# EAGLE design PNPController (EAGLE 9.4.2)
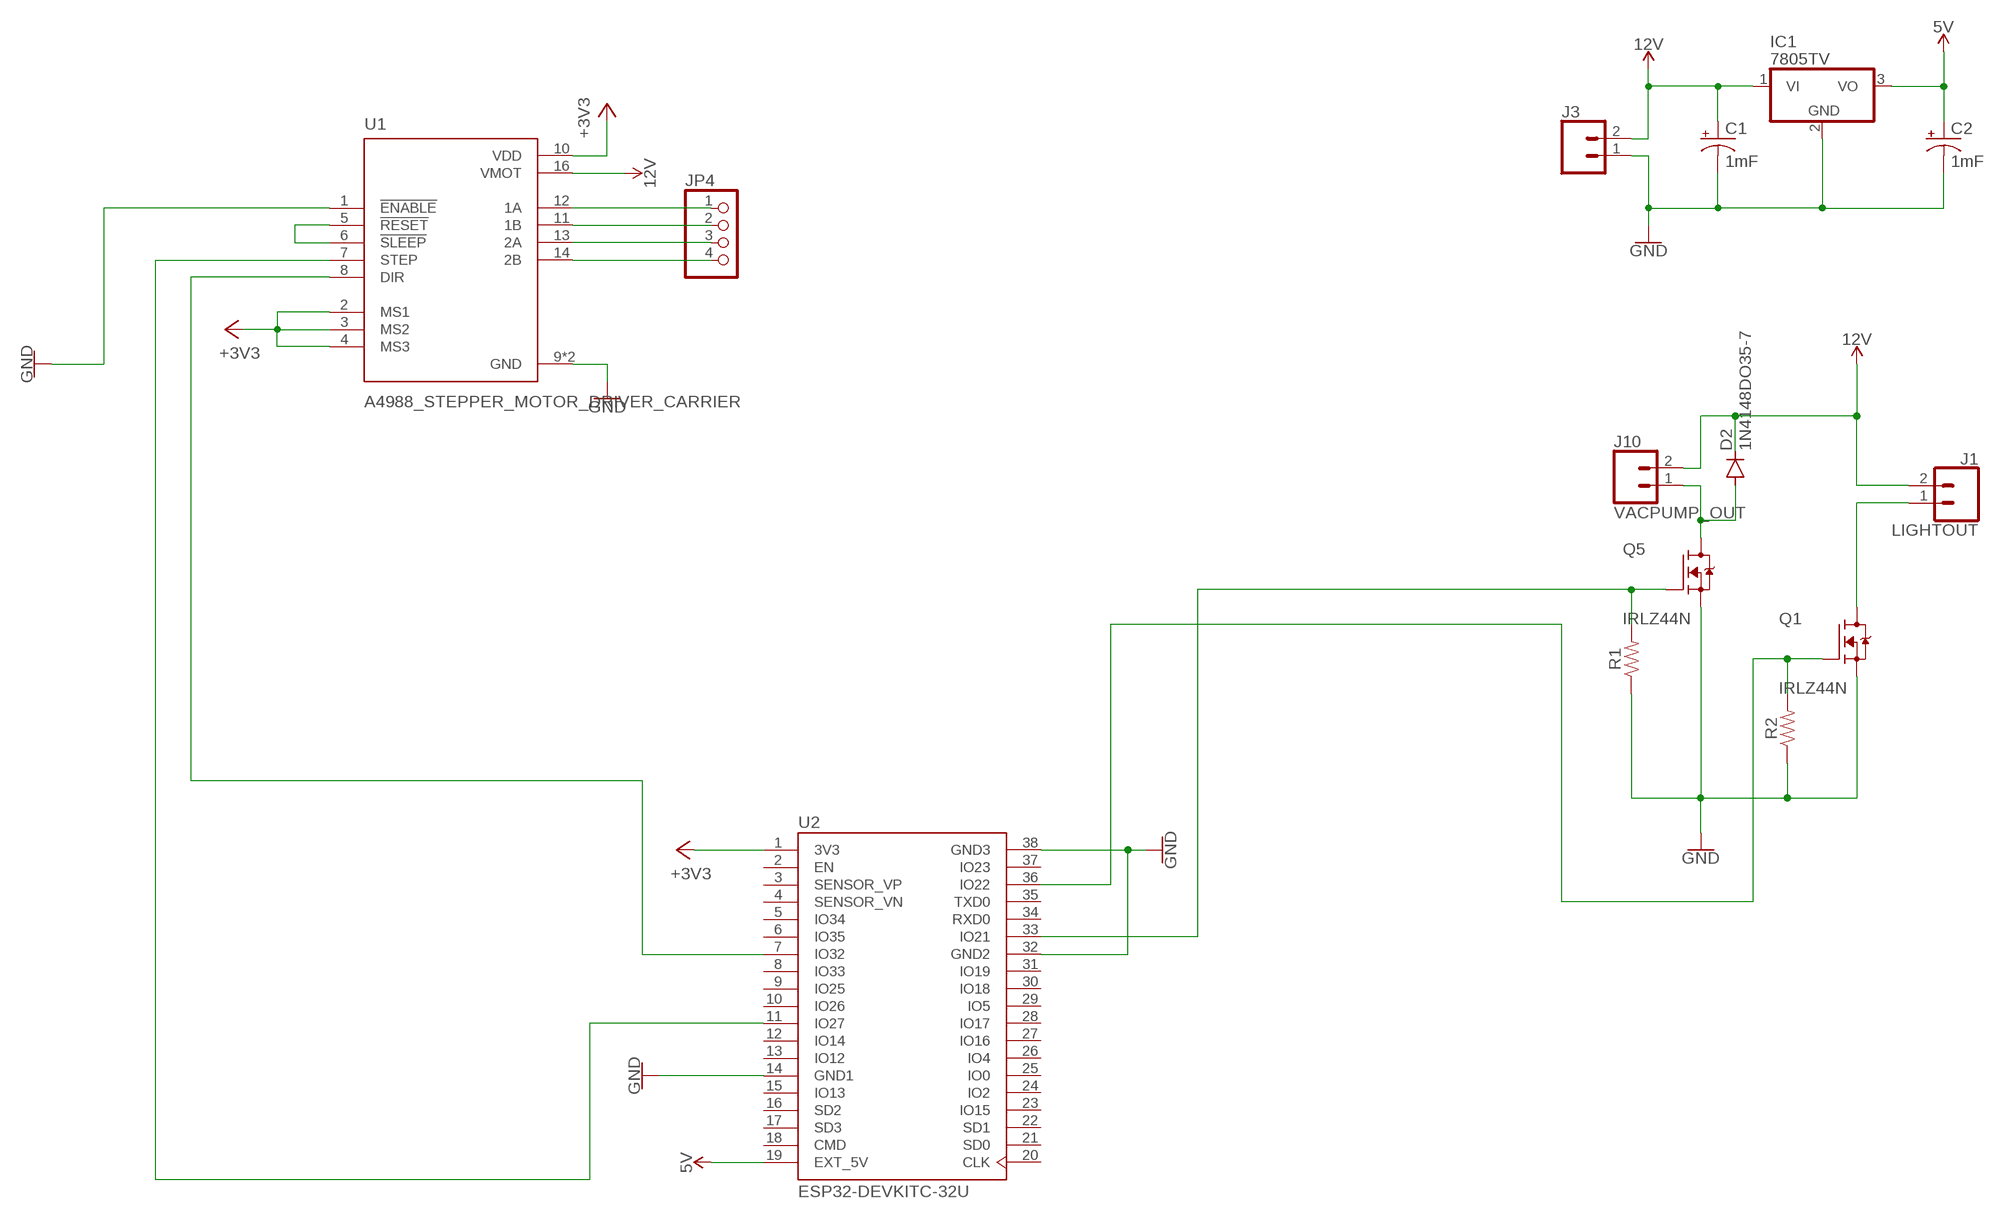
[diagram p0: schematic, sheet 1]

## Parts
C1  1mF  1000UF-RADIAL-5MM-25V-20%  [CPOL-RADIAL-5MM-10MM]
C2  1mF  1000UF-RADIAL-5MM-25V-20%  [CPOL-RADIAL-5MM-10MM]
D2  1N4148DO35-7  [DO35-7]
IC1  7805TV  [TO220V]
J1  LIGHTOUT  CONN_023.5MM  [SCREWTERMINAL-3.5MM-2]
J3  CONN_025MM  [SCREWTERMINAL-5MM-2]
J10  VACPUMP_OUT  CONN_023.5MM  [SCREWTERMINAL-3.5MM-2]
JP4  PINHD-1X4  [1X04]
Q1  IRLZ44N  [TO254P1054X469X1930-3]
Q5  IRLZ44N  [TO254P1054X469X1930-3]
R1  RESISTORAXIAL-0.3  [AXIAL-0.3]
R2  RESISTORAXIAL-0.3  [AXIAL-0.3]
U1  A4988_STEPPER_MOTOR_DRIVER_CARRIER  [MODULE_A4988_STEPPER_MOTOR_DRIVER_CARRIER]
U2  ESP32-DEVKITC-32U  [MODULE_ESP32-DEVKITC-32U]

## Nets
5V: C2.+ IC1.3(VO) U2.19(EXT_5V)
12V: C1.+ D2.C IC1.1(VI) J1.2 J3.2 J10.2 U1.16(VMOT)
+3V3: U1.2(MS1) U1.3(MS2) U1.4(MS3) U1.10(VDD) U2.1(3V3)
GND: C1.- C2.- IC1.2(GND) J3.1 Q1.3(S) Q5.3(S) R1.P$1 R2.P$1 U1.1(!ENABLE) U1.9(GND) U1.15(GND) U2.14(GND1) U2.32(GND2) U2.38(GND3)
N$3: JP4.1 U1.12(1A)
N$4: JP4.2 U1.11(1B)
N$6: JP4.3 U1.13(2A)
N$7: JP4.4 U1.14(2B)
N$12: U1.5(!RESET) U1.6(!SLEEP)
N$15: D2.A J10.1 Q5.2(D)
N$16: J1.1 Q1.2(D)
N$19: Q5.1(G) R1.P$2 U2.33(IO21)
N$20: Q1.1(G) R2.P$2 U2.36(IO22)
N$22: U1.7(STEP) U2.11(IO27)
N$23: U1.8(DIR) U2.7(IO32)
Unconnected: U2.2(EN) U2.3(SENSOR_VP) U2.4(SENSOR_VN) U2.5(IO34) U2.6(IO35) U2.8(IO33) U2.9(IO25) U2.10(IO26) U2.12(IO14) U2.13(IO12) U2.15(IO13) U2.16(SD2) U2.17(SD3) U2.18(CMD) U2.20(CLK) U2.21(SD0) U2.22(SD1) U2.23(IO15) U2.24(IO2) U2.25(IO0) U2.26(IO4) U2.27(IO16) U2.28(IO17) U2.29(IO5) U2.30(IO18) U2.31(IO19) U2.34(RXD0) U2.35(TXD0) U2.37(IO23)

## Library data of the parts
C1 C2 = SparkFun-Capacitors:1000UF: 1,000µF/1mF ceramic capacitors A capacitor is a passive two-terminal electrical component used to store electrical energy temporarily in an electric field. CAP-08070; PROD_ID: CAP-09538
D2 = diode:1N4148: DIODE high speed (Philips)
IC1 = linear:78*: Positive VOLTAGE REGULATOR Source: http://cache.national.com/ds/LM/LM78L05.pdf http://www.fairchildsemi.com/ds/LM/LM7805.pdf
J1 J10 = SparkFun-Connectors:CONN_02: Multi connection point. Often used as Generic Header-pin footprint for 0.1 inch spaced/style header connections On any of the 0.1 inch spaced packages, you can populate with these: Break Away Headers - Straight <https://www.sparkfun.com/products/116> (PRT-00116) Break Away Male Headers - Right Angle <https://www.sparkfun.com/products/553> (PRT-00553) Female Headers <https://www.sparkfun.com/products/115> (PRT-00115) Break Away Headers - Machine Pin <https://www.sparkfun.com/products/117> (PRT-00117) Break Away Female Headers - Swiss Machine Pin <https://www.sparkfun.com/products/743> (PRT-00743) For SCREWTERMINALS and SPRING TERMINALS visit here: Screw Terimnals on SparkFun.com <https://www.sparkfun.com/search/results?term=Screw+Terminals> (5mm/3.5mm/2.54mm spacing) This device is also useful as a general connection point to wire up your design to another part of your project. Our various solder wires solder well into these plated through hole pads. Hook-Up Wire - Assortment (Stranded, 22 AWG) <https://www.sparkfun.com/products/11375> (PRT-11375) Hook-Up Wire - Assortment (Solid Core, 22 AWG) <https://www.sparkfun.com/products/11367> (PRT-11367) View the entire wire category on our website here <https://www.sparkfun.com/categories/141> Special notes: Molex polarized connector foot print use with: PRT-08233 with associated crimp pins and housings. 2.54_SCREWTERM for use with PRT-10571. 3.5mm Screw Terminal footprints for PRT-08084 5mm Screw Terminal footprints for use with PRT-08432; PROD_ID: CONN-08399
J3 = SparkFun-Connectors:CONN_02: Multi connection point. Often used as Generic Header-pin footprint for 0.1 inch spaced/style header connections On any of the 0.1 inch spaced packages, you can populate with these: Break Away Headers - Straight <https://www.sparkfun.com/products/116> (PRT-00116) Break Away Male Headers - Right Angle <https://www.sparkfun.com/products/553> (PRT-00553) Female Headers <https://www.sparkfun.com/products/115> (PRT-00115) Break Away Headers - Machine Pin <https://www.sparkfun.com/products/117> (PRT-00117) Break Away Female Headers - Swiss Machine Pin <https://www.sparkfun.com/products/743> (PRT-00743) For SCREWTERMINALS and SPRING TERMINALS visit here: Screw Terimnals on SparkFun.com <https://www.sparkfun.com/search/results?term=Screw+Terminals> (5mm/3.5mm/2.54mm spacing) This device is also useful as a general connection point to wire up your design to another part of your project. Our various solder wires solder well into these plated through hole pads. Hook-Up Wire - Assortment (Stranded, 22 AWG) <https://www.sparkfun.com/products/11375> (PRT-11375) Hook-Up Wire - Assortment (Solid Core, 22 AWG) <https://www.sparkfun.com/products/11367> (PRT-11367) View the entire wire category on our website here <https://www.sparkfun.com/categories/141> Special notes: Molex polarized connector foot print use with: PRT-08233 with associated crimp pins and housings. 2.54_SCREWTERM for use with PRT-10571. 3.5mm Screw Terminal footprints for PRT-08084 5mm Screw Terminal footprints for use with PRT-08432; SF_SKU: PRT-08432
JP4 = pinhead:PINHD-1X4: PIN HEADER
Q1 Q5 = IRLZ44N:IRLZ44N: 55V Single N-Channel HEXFET Power MOSFET in a TO-220AB package Check availability <https://pricing.snapeda.com/parts/IRLZ44N/Infineon%20/%20IR/view-part?ref=eda>; AVAILABILITY: In Stock; DESCRIPTION: N-Channel 55 V 47A (Tc) 3.8W (Ta), 110W (Tc) Surface Mount D2PAK; MF: Infineon / IR; MP: IRLZ44N; PACKAGE: TO-220-3 Infineon / IR; PRICE: None; PURCHASE-URL: https://pricing.snapeda.com/search/part/IRLZ44N/?ref=eda
R1 R2 = SparkFun-Resistors:RESISTOR: Generic Resistor Package
U1 = A4988_STEPPER_MOTOR_DRIVER_CARRIER:A4988_STEPPER_MOTOR_DRIVER_CARRIER: Stepper motor controler; IC: A4988; 1A; Uin mot: 8÷35V Check availability <https://pricing.snapeda.com/parts/A4988%20STEPPER%20MOTOR%20DRIVER%20CARRIER/Pololu/view-part?ref=eda>; AVAILABILITY: Not in stock; CHECK_PRICES: https://www.snapeda.com/parts/A4988%20STEPPER%20MOTOR%20DRIVER%20CARRIER/Pololu/view-part/?ref=eda; DESCRIPTION: Stepper Motor Driver; MF: Pololu; MP: A4988 STEPPER MOTOR DRIVER CARRIER; PACKAGE: None; PRICE: None; SNAPEDA_LINK: https://www.snapeda.com/parts/A4988%20STEPPER%20MOTOR%20DRIVER%20CARRIER/Pololu/view-part/?ref=snap
U2 = ESP32-DEVKITC-32U:ESP32-DEVKITC-32U: ESP32-DEVKITC Check availability <https://pricing.snapeda.com/parts/ESP32-DEVKITC-32U/Espressif%20Systems/view-part?ref=eda>; AVAILABILITY: In Stock; CHECK_PRICES: https://www.snapeda.com/parts/ESP32-DEVKITC-32U/Espressif+Systems/view-part/?ref=eda; DESCRIPTION: ESP32-WROOM-32UE series Transceiver; 802.11 b/g/n (Wi-Fi, WiFi, WLAN), Bluetooth® Smart Ready 4.x Dual Mode Evaluation Board; MF: Espressif Systems; MP: ESP32-DEVKITC-32U; PACKAGE: CUSTOM-38 ESPRESSIF; PRICE: None; PURCHASE-URL: https://www.snapeda.com/api/url_track_click_mouser/?unipart_id=2781909&manufacturer=Espressif Systems&part_name=ESP32-DEVKITC-32U&search_term=esp32-devkitc-32u; SNAPEDA_LINK: https://www.snapeda.com/parts/ESP32-DEVKITC-32U/Espressif+Systems/view-part/?ref=snap

## Net classes
0 default: width 0.914 mm, clearance 0.457 mm

## Board
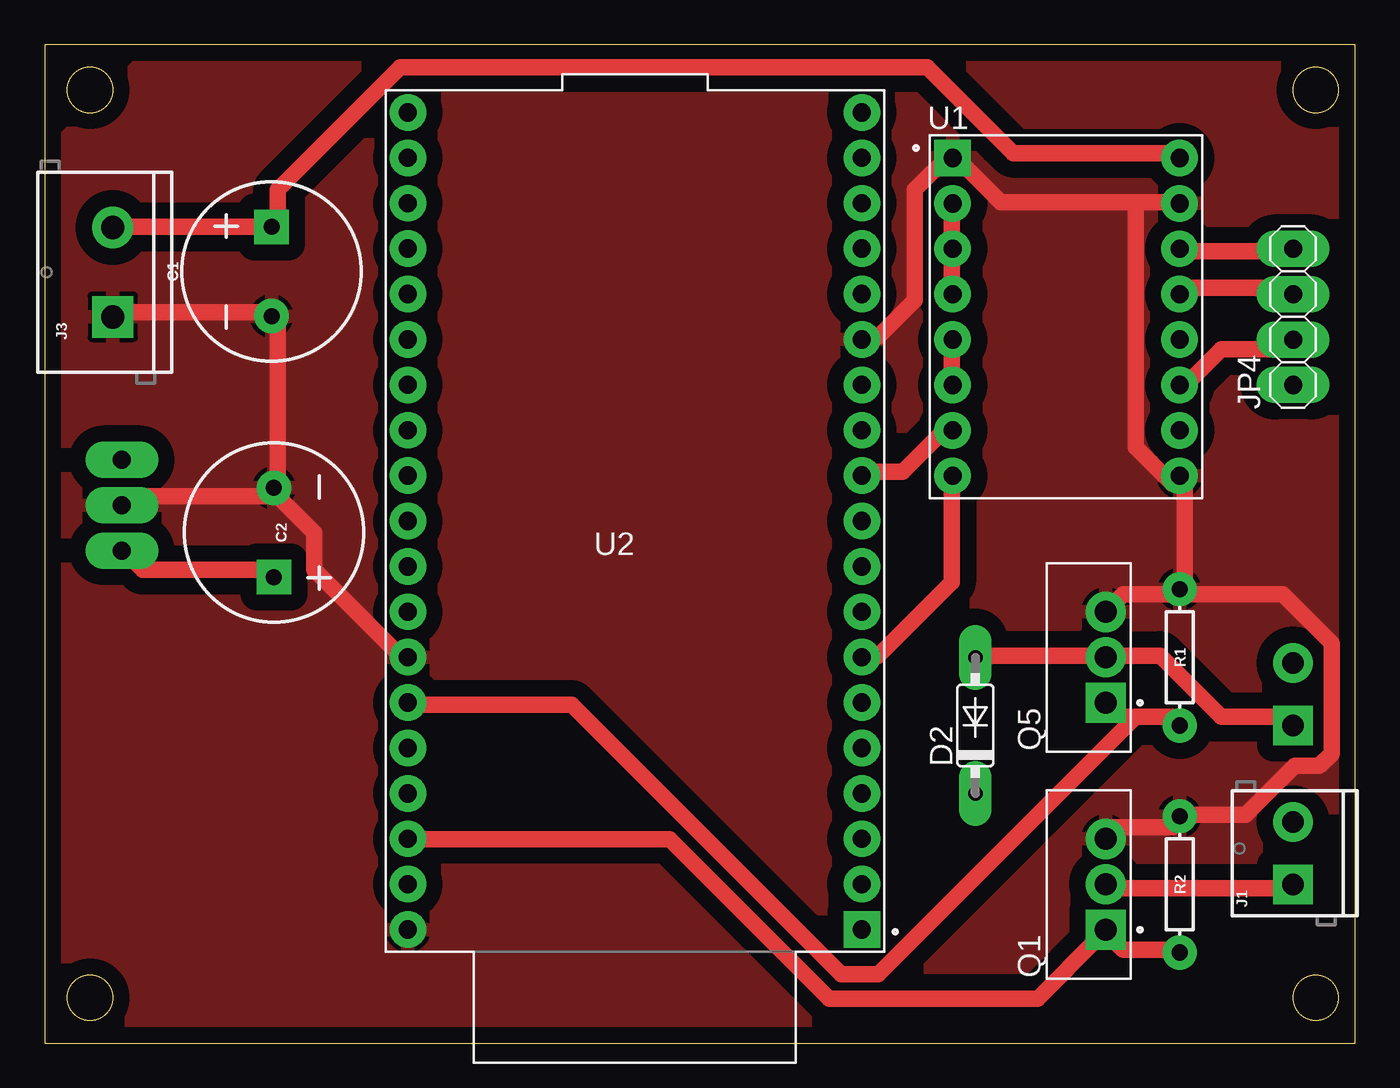
[diagram p1: board, top side]
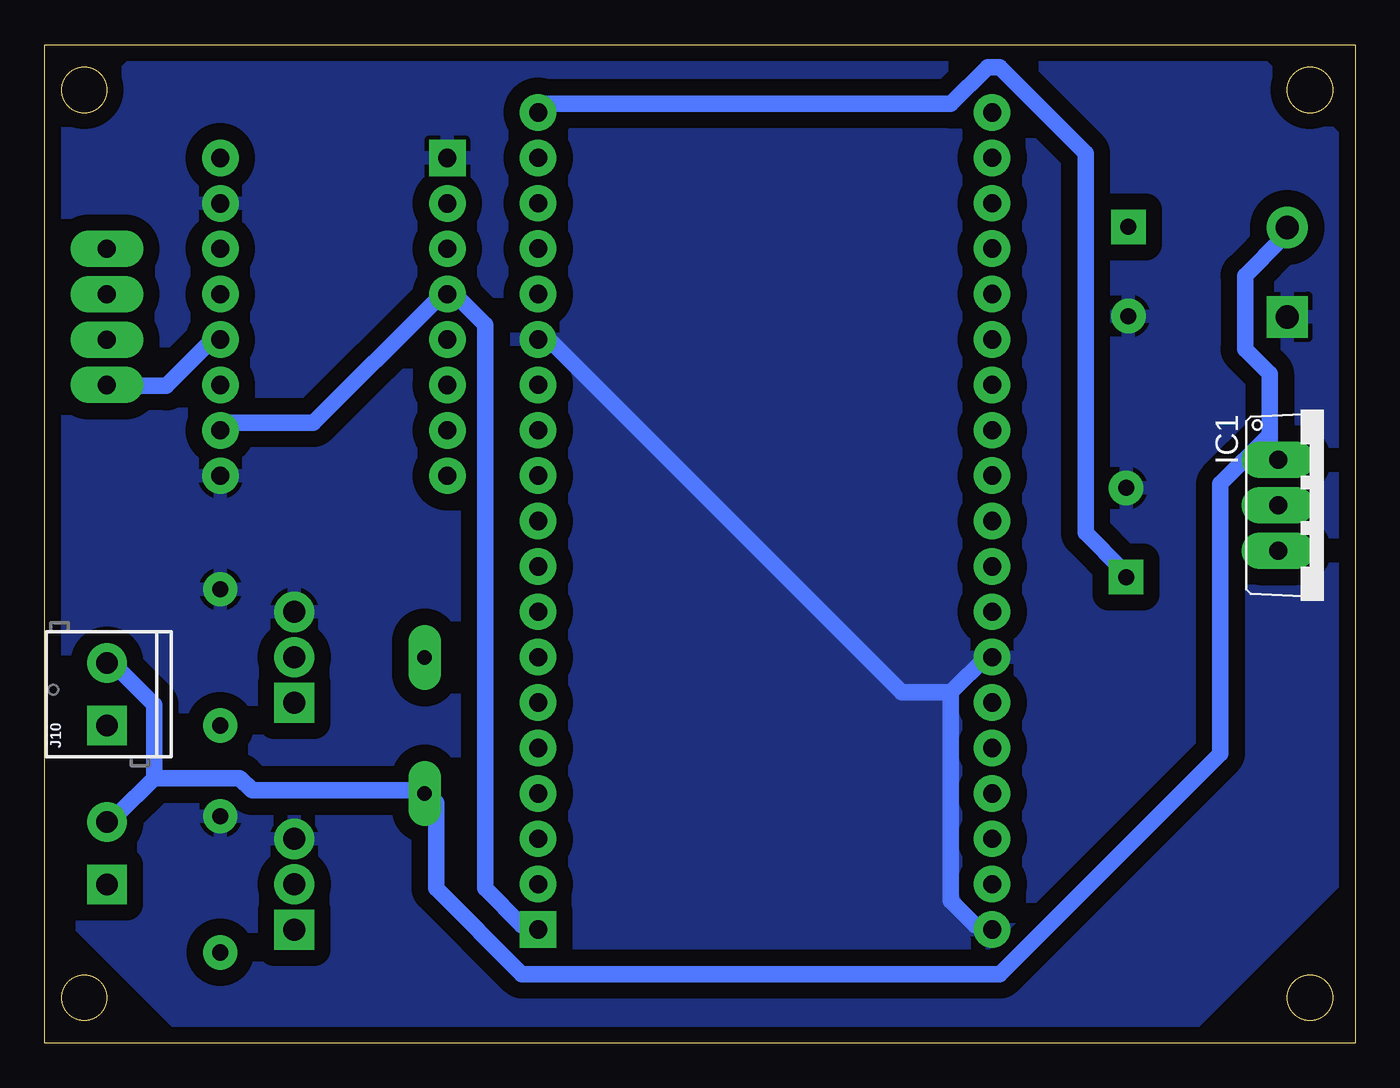
[diagram p2: board, bottom side, seen from below]

Size 73.33 x 55.87 mm. Coordinates in mm from the lower left corner, seen from the top.
Outline: 0,0 73.33,0 73.33,55.87 0,55.87 0,0
Outline: circle at 2.54,53.34 radius 1.27
Outline: circle at 71.12,53.34 radius 1.27
Outline: circle at 2.54,2.54 radius 1.27
Outline: circle at 71.12,2.54 radius 1.27
Copper layers (1*16): Top 0.035mm / dielectric 1.5mm / Bottom 0.035mm
Design rules "default *": minimum track width 30mil, minimum drill 0.5mm, track to track 10mil, track to pad 10mil, pad to pad 10mil, via to via 10mil, smd to smd 10mil, copper to edge 30mil, drill to drill 30mil, minimum pad ring 20mil, minimum via ring 20mil, stop-mask expansion 2mil, vias tented up to drill 0mil, thermal gap 10mil

### Footprints (pad centres in the part's own frame; a part is rotated, then mirrored left to right if it is on the bottom)
CPOL-RADIAL-5MM-10MM = drill 0.9 pad 1.93 square: + 2.5,0 | drill 0.9 pad 1.93: - -2.5,0
DO35-7 = drill 0.813 long: A 3.81,0; C -3.81,0
TO220V = drill 1.016 long: 1 -2.54,-2.54; 2 0,-2.54; 3 2.54,-2.54
SCREWTERMINAL-3.5MM-2 = drill 1.2 pad 2.032 square: 1 0,0 | drill 1.2 pad 2.032: 2 3.5,0
SCREWTERMINAL-5MM-2 = drill 1.3 pad 2.032 square: 1 0,0 | drill 1.3 pad 2.032: 2 5,0
1X04 = drill 1.016 long: 1 -3.81,0; 2 -1.27,0; 3 1.27,0; 4 3.81,0
TO254P1054X469X1930-3 = drill 1.23 pad 1.85 square: 1 -2.54,-0.94 | drill 1.23 pad 1.85: 2 0,-0.94; 3 2.54,-0.94
AXIAL-0.3 = drill 0.9 pad 1.88: P$1 -3.81,0; P$2 3.81,0
MODULE_A4988_STEPPER_MOTOR_DRIVER_CARRIER = drill 1.02 square: 1 -6.35,8.89 | drill 1.02: 2 -6.35,6.35; 3 -6.35,3.81; 4 -6.35,1.27; 5 -6.35,-1.27; 6 -6.35,-3.81; 7 -6.35,-6.35; 8 -6.35,-8.89; 9 6.35,-8.89; 10 6.35,-6.35; 11 6.35,-3.81; 12 6.35,-1.27; 13 6.35,1.27; 14 6.35,3.81; 15 6.35,6.35; 16 6.35,8.89
MODULE_ESP32-DEVKITC-32U = drill 1.02 square: 1 -12.7,22.85 | drill 1.02: 2 -12.7,20.31; 3 -12.7,17.77; 4 -12.7,15.23; 5 -12.7,12.69; 6 -12.7,10.15; 7 -12.7,7.61; 8 -12.7,5.07; 9 -12.7,2.53; 10 -12.7,-0.01; 11 -12.7,-2.55; 12 -12.7,-5.09; 13 -12.7,-7.63; 14 -12.7,-10.17; 15 -12.7,-12.71; 16 -12.7,-15.25; 17 -12.7,-17.79; 18 -12.7,-20.33; 19 -12.7,-22.87; 20 12.7,-22.87; 21 12.7,-20.33; 22 12.7,-17.79; 23 12.7,-15.25; 24 12.7,-12.71; 25 12.7,-10.17; 26 12.7,-7.63; 27 12.7,-5.09; 28 12.7,-2.55; 29 12.7,-0.01; 30 12.7,2.53; 31 12.7,5.07; 32 12.7,7.61; 33 12.7,10.15; 34 12.7,12.69; 35 12.7,15.23; 36 12.7,17.77; 37 12.7,20.31; 38 12.7,22.85

### Placement (x,y rotation side)
C1  12.7,43.18 90 top
C2  12.83,28.58 270 top
D2  52.07,17.78 90 top
IC1  1.78,30.1 270 bottom
J1  69.85,8.89 90 top
J3  3.81,40.64 90 top
J10  69.85,17.78 90 bottom
JP4  69.85,40.64 90 top
Q1  58.42,8.89 90 top
Q5  58.42,21.59 90 top
R1  63.5,21.59 270 top
R2  63.5,8.89 270 top
U1  57.15,40.64 0 top
U2  33.02,29.21 180 top

### Tracks (layer width: path | path; a pad name or v marks a point on that pad's centre or on a via)
5V
  Top 0.914: C2.+ 12.34,26.49 5.49,26.49 4.8,27.18 IC1.3
  Bottom 0.914: U2.19 45.26,52.55 22.63,52.55 20.57,54.61 19.89,54.61 15.09,49.81 15.09,28.55 13.03,26.49 C2.+
12V
  Top 0.914: J3.2 4.12,45.7 12.34,45.7 C1.+ 13.03,45.7 13.03,47.75 19.89,54.61 49.38,54.61 54.18,49.81 63.09,49.81 U1.16
  Bottom 0.914: 67.21,14.83 62.41,14.83 61.72,14.15 52.12,14.15 D2.C 51.44,13.46 51.44,8.66 46.63,3.86 19.89,3.86 7.54,16.2 7.54,31.29 4.8,34.04 | 67.21,14.83 69.27,12.78 J1.2 | 67.21,14.83 67.21,18.95 69.27,21.01 J10.2 | 4.8,34.04 4.8,37.47 6.17,38.84 6.17,42.95 4.12,45.01 J3.2 | 4.8,34.04 4.8,32.66 IC1.1
+3V3
  Top 0.914: U1.2 50.75,46.38 50.75,45.01 U1.3 50.75,44.32 50.75,42.27 U1.4
  Bottom 0.914: U2.1 45.95,6.6 46.63,6.6 48.69,8.66 48.69,40.21 50.75,42.27 U1.4 51.44,41.58 58.29,34.72 63.09,34.72 U1.10
GND
  Top 0.914: C2.- 12.34,30.61 4.8,30.61 IC1.2 | J3.1 4.12,40.89 12.34,40.89 C1.- 13.03,40.21 13.03,31.29 C2.- | U2.32 19.89,21.69 15.09,26.49 15.09,28.55 13.03,30.61 C2.- | U2.14 45.95,39.52 46.63,39.52 48.69,41.58 48.69,47.75 50.75,49.81 U1.1 51.44,49.12 53.49,47.07 61.04,47.07 | 61.04,47.07 63.09,47.07 U1.15 | Q1.3 59.66,12.09 63.09,12.09 R2.P$1 63.78,12.78 67.21,12.78 69.95,15.52 71.32,15.52 72.01,16.2 72.01,22.38 69.27,25.12 63.78,25.12 R1.P$1 | R1.P$1 63.09,25.12 60.35,25.12 59.66,24.44 Q5.3 | R1.P$1 63.78,25.81 63.78,31.29 U1.9 63.09,31.29 61.04,33.35 61.04,47.07
  Bottom 0.914: 22.63,19.63 22.63,7.98 21.26,6.6 20.57,6.6 U2.38 | 22.63,19.63 20.57,21.69 U2.32 | 22.63,19.63 25.38,19.63 45.26,39.52 U2.14
  pour Top (isolate 0.914): 0,49.53 6.35,55.88 69.85,55.88 73.66,52.07 73.66,3.81 69.85,0 6.35,0 5.08,0 0,5.08
  pour Bottom (isolate 0.914): 0,49.53 6.35,55.88 67.31,55.88 72.39,50.8 72.39,7.62 66.04,1.27 11.43,1.27 8.89,1.27 1.27,8.89 0,10.16
N$3
  Bottom 0.914: JP4.1 69.27,36.78 66.52,36.78 63.78,39.52 U1.12
N$4
  Top 0.914: JP4.2 69.27,38.84 65.84,38.84 63.78,36.78 U1.11
N$6
  Top 0.914: JP4.3 69.27,42.27 63.78,42.27 U1.13
N$7
  Top 0.914: JP4.4 69.27,44.32 63.78,44.32 U1.14
N$12
  Top 0.914: U1.6 50.75,37.47 50.75,38.84 U1.5
N$15
  Top 0.914: D2.A 52.12,21.69 58.98,21.69 Q5.2 59.66,21.69 62.41,21.69 65.84,18.26 69.27,18.26 J10.1
N$16
  Top 0.914: J1.1 69.27,8.66 59.66,8.66 Q1.2
N$19
  Top 0.914: 61.04,18.26 60.35,18.26 59.66,18.95 Q5.1 | 61.04,18.26 63.09,18.26 R1.P$2 | 61.04,18.26 46.63,3.86 44.58,3.86 29.49,18.95 20.57,18.95 U2.33
N$20
  Top 0.914: R2.P$2 63.09,5.23 60.35,5.23 59.66,5.92 Q1.1 58.98,5.92 55.55,2.49 43.89,2.49 34.98,11.4 20.57,11.4 U2.36
N$22
  Top 0.914: U2.11 45.95,31.98 48.01,31.98 50.75,34.72 U1.7
N$23
  Top 0.914: U2.7 45.95,21.69 46.63,21.69 50.75,25.81 50.75,31.29 U1.8